# Altium schematic sheet Payload_ESP.SchDoc
size A; SheetNumber: 1; SheetTotal: 1
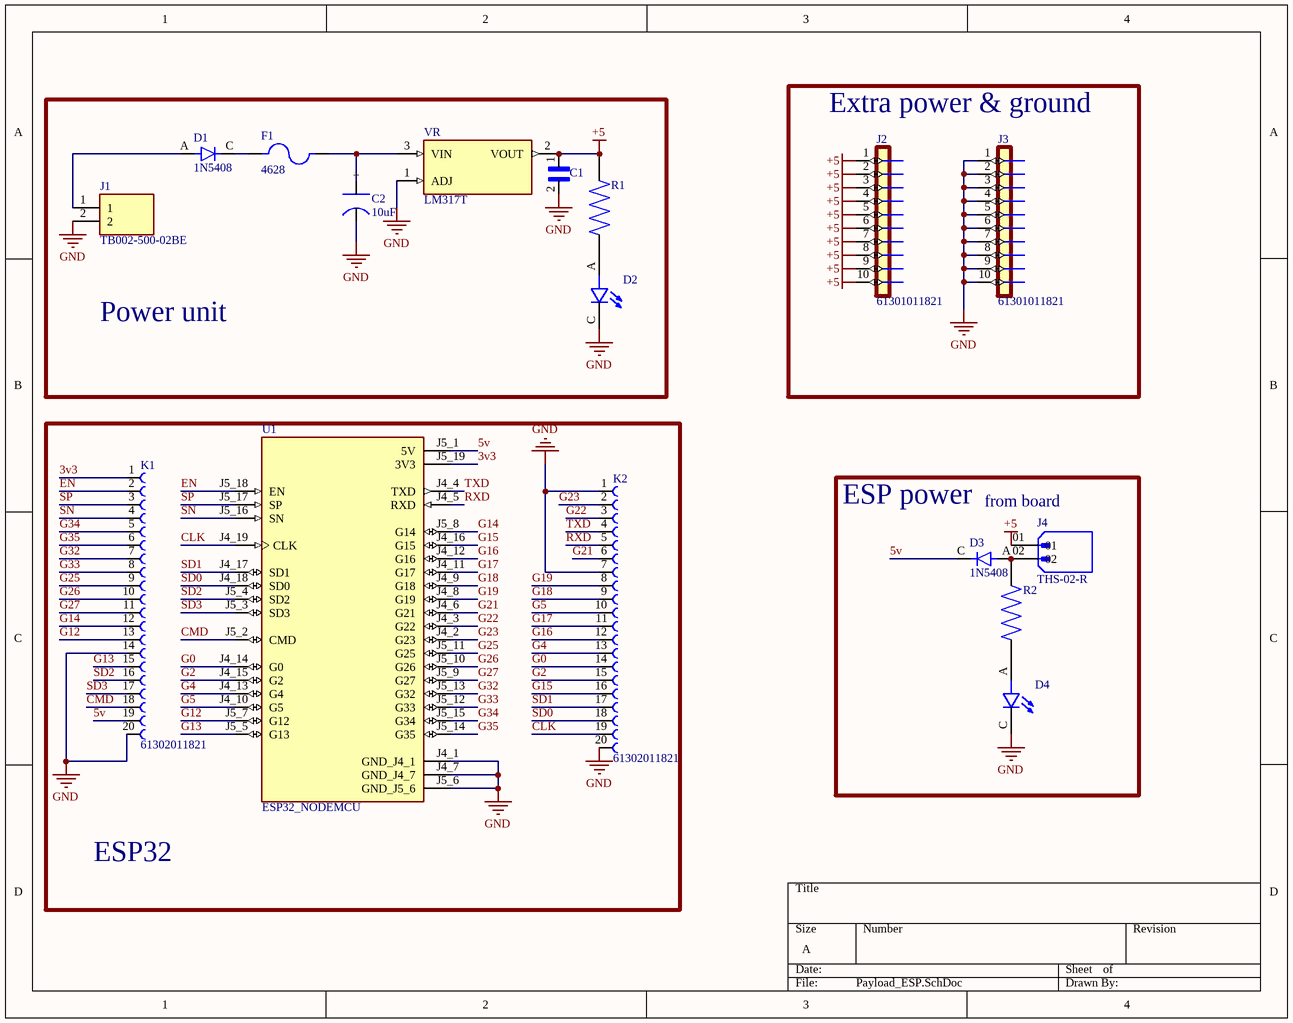
[diagram p0: Payload_ESP.SchDoc]

## Parts
C1  FA14X8R1H104KNU06  [CAPRB250W50L450T300H550]  (value not drawn)
C2  10uF  [860020672010]
D1  1N5408  [DIOAD2006W127L950D530]
D2  151054RS03000  [LED_151054RS03000]  (value not drawn)
D3  1N5408  [DIOAD2006W127L950D530]
D4  151054RS03000  [LED_151054RS03000]  (value not drawn)
F1  4628  [FUSE_4628]
J1  TB002-500-02BE  [CUI_TB002-500-02BE]
J2  61301011821  [1X10-PIN]
J3  61301011821  [1X10-PIN]
J4  THS-02-R  [VALCON_THS-02-R]
K1  61302011821  [61302011821]
K2  61302011821  [61302011821]
R1  MFR-25FBF52-1K  [RESAD1100W55L680D260]  (value not drawn)
R2  MFR-25FBF52-1K  [RESAD1100W55L680D260]  (value not drawn)
U1  ESP32_NODEMCU  [MODULE_ESP32_NODEMCU]
VR  LM317T  [TO254P1054X470X1955-3]

## Blocks framed on the sheet
Power unit: C1 C2 D1 D2 F1 J1 R1 VR
Extra power & ground: J2 J3
ESP32: K1 K2 U1
ESP power: D3 D4 J4 R2

## Nets
+5: C1.1 J2.1 J2.2 J2.3 J2.4 J2.5 J2.6 J2.7 J2.8 J2.9 J2.10 J4.01 R1.2 VR.2(VOUT)
GND: C1.2 C2.2(-) D2.C D4.C J1.2 J3.1 J3.2 J3.3 J3.4 J3.5 J3.6 J3.7 J3.8 J3.9 J3.10 K1.14 K1.20 K2.1 K2.7 K2.20 U1.J4_1(GND_J4_1) U1.J4_7(GND_J4_7) U1.J5_6(GND_J5_6) VR.1(ADJ)
3v3: K1.1 U1.J5_19(3V3)
5v: D3.C K1.19 U1.J5_1(5V)
CLK: K2.19 U1.J4_19(CLK)
CMD: K1.18 U1.J5_2(CMD)
EN: K1.2 U1.J5_18(EN)
G0: K2.14 U1.J4_14(G0)
G2: K2.15 U1.J4_15(G2)
G4: K2.13 U1.J4_13(G4)
G5: K2.10 U1.J4_10(G5)
G12: K1.13 U1.J5_7(G12)
G13: K1.15 U1.J5_5(G13)
G14: K1.12 U1.J5_8(G14)
G15: K2.16 U1.J4_16(G15)
G16: K2.12 U1.J4_12(G16)
G17: K2.11 U1.J4_11(G17)
G18: K2.9 U1.J4_9(G18)
G19: K2.8 U1.J4_8(G19)
G21: K2.6 U1.J4_6(G21)
G22: K2.3 U1.J4_3(G22)
G23: K2.2 U1.J4_2(G23)
G25: K1.9 U1.J5_11(G25)
G26: K1.10 U1.J5_10(G26)
G27: K1.11 U1.J5_9(G27)
G32: K1.7 U1.J5_13(G32)
G33: K1.8 U1.J5_12(G33)
G34: K1.5 U1.J5_15(G34)
G35: K1.6 U1.J5_14(G35)
RXD: K2.5 U1.J4_5(RXD)
SD0: K2.18 U1.J4_18(SD0)
SD1: K2.17 U1.J4_17(SD1)
SD2: K1.16 U1.J5_4(SD2)
SD3: K1.17 U1.J5_3(SD3)
SN: K1.4 U1.J5_16(SN)
SP: K1.3 U1.J5_17(SP)
TXD: K2.4 U1.J4_4(TXD)
NetC2_1: C2.1(+) F1.2 VR.3(VIN)
NetD1_A: D1.A J1.1
NetD1_C: D1.C F1.1
NetD2_A: D2.A R1.1
NetD3_A: D3.A J4.02 R2.2
NetD4_A: D4.A R2.1

## Notes on the sheet
- from board

## Library data of the parts
C1 = FA14X8R1H104KNU06: 0.1 ÂµF Â±10% 50V Ceramic Capacitor X8R Radial; MF: TDK; Check_prices: https://www.snapeda.com/parts/FA14X8R1H104KNU06/TDK/view-part/?ref=eda; Purchase-URL: https://pricing.snapeda.com/search/part/FA14X8R1H104KNU06/?ref=eda; Price: None; Availability: In Stock; Package: Radial TDK; SnapEDA_Link: https://www.snapeda.com/parts/FA14X8R1H104KNU06/TDK/view-part/?ref=snap; Value: *; MP: FA14X8R1H104KNU06
C2 = 860020672010: / THT capacitor 10 µF 50 V .              Aluminum Electrolytic Capacitors Radial, Can 2000 Hrs @ 105°C; P/N: 860020672010; value: 10uF
D1 D3 = 1N5408: Diode Standard 1000V 3A Through Hole DO-201AD; MF: ON; Package: AXIAL LEAD-2 ON Semiconductor; Check_prices: https://www.snapeda.com/parts/1N5408/Onsemi/view-part/?ref=eda; Value: *; MP: 1N5408; Availability: In Stock; SnapEDA_Link: https://www.snapeda.com/parts/1N5408/Onsemi/view-part/?ref=snap; Price: None
D2 D4 = 151054RS03000: Red 623nm LED Indication - Discrete 1.9V Radial; MF: Wurth Elektronik; Value: *; SnapEDA_Link: https://www.snapeda.com/parts/151054RS03000/Wurth+Elektronik/view-part/?ref=snap; Purchase-URL: https://pricing.snapeda.com/search/part/151054RS03000/?ref=eda; Availability: In Stock; Price: None; Package: Radial Wurth Elektronik; Check_prices: https://www.snapeda.com/parts/151054RS03000/Wurth+Elektronik/view-part/?ref=eda; MP: 151054RS03000
F1 = 4628: 5mm Slim Line Fuse holder; MF: Keystone; Check_prices: https://www.snapeda.com/parts/4628/Keystone/view-part/?ref=eda; Value: *; Availability: In Stock; MP: 4628; Price: None; Package: None; SnapEDA_Link: https://www.snapeda.com/parts/4628/Keystone/view-part/?ref=snap; Purchase-URL: https://pricing.snapeda.com/search/part/4628/?ref=eda
J1 = TB002-500-02BE: 2~24 Poles, Screw Type, Horizontal, 5.0 Pitch, 22~12 (AWG), Terminal Block Connector; MF: CUI Devices; Purchase-URL: https://pricing.snapeda.com/search/part/TB002-500-02BE/?ref=eda; MP: TB002-500-02BE; Package: None; Price: None; Availability: In Stock; SnapEDA_Link: https://www.snapeda.com/parts/TB002-500-02BE/CUI+Devices/view-part/?ref=snap; Value: *; Check_prices: https://www.snapeda.com/parts/TB002-500-02BE/CUI+Devices/view-part/?ref=eda; CUI_purchase_URL: https://www.cuidevices.com/product/interconnect/connectors/terminal-blocks/tb002-500-series?utm_source=snapeda.com&utm_medium=referral&utm_campaign=snapedaBOM
J2 J3 = 61301011821: 10 Position Header Connector 0.100 (2.54mm) Through Hole Gold; MF: Wurth Electronics; SnapEDA_Link: https://www.snapeda.com/parts/61301011821/Wurth+Electronics+Inc./view-part/?ref=snap; Package: None; Value: *; MP: 61301011821; Check_prices: https://www.snapeda.com/parts/61301011821/Wurth+Electronics+Inc./view-part/?ref=eda
K1 K2 = 61302011821: 20 Position Receptacle Connector 0.100 (2.54mm) Through Hole Gold; MF: WÃ¼rth Elektronik; SnapEDA_Link: https://www.snapeda.com/parts/61302011821/Wurth+Elektronik/view-part/?ref=snap; Package: None; Value: *; MP: 61302011821; Check_prices: https://www.snapeda.com/parts/61302011821/Wurth+Elektronik/view-part/?ref=eda
R1 R2 = MFR-25FBF52-1K: 1.07 kOhms Â±1% 0.25W, 1/4W Through Hole Resistor Axial - Metal Film; MF: Yageo; Value: *; SnapEDA_Link: https://www.snapeda.com/parts/MFR-25FBF52-1K/Yageo/view-part/?ref=snap; Purchase-URL: https://pricing.snapeda.com/search/part/MFR-25FBF52-1K/?ref=eda; Availability: In Stock; Price: None; Package: Axial Yageo; Check_prices: https://www.snapeda.com/parts/MFR-25FBF52-1K/Yageo/view-part/?ref=eda; MP: MFR-25FBF52-1K
U1 = ESP32_NODEMCU: NodeMCU is an open source loT platform. ESP32 is a series of low cost, low powersystem-on-chip (SoC) microcontrollers with integrated Wi-Fi & dual-mode Bluetooth.; MF: Espressif Systems; MP: ESP32 NODEMCU; SnapEDA_Link: https://www.snapeda.com/parts/ESP32%20NODEMCU/Espressif+Systems/view-part/?ref=snap; Package: Package; Value: *; Check_prices: https://www.snapeda.com/parts/ESP32%20NODEMCU/Espressif+Systems/view-part/?ref=eda
VR = LM317T: Linear Voltage Regulator IC 1 Output 1.5A TO-220-3; MF: Texas Instruments; Package: TO-220 Texas Instruments; Price: None; Availability: Unavailable; MP: LM317T; SnapEDA_Link: https://www.snapeda.com/parts/LM317T/Texas%20Instruments/view-part/6933/?ref=snap; Value: *
J4 = THS-02-R: Value: *; Price: None; Package: None; Availability: Unavailable; MP: THS-02-R